# Altium schematic sheet 1.POWER.SchDoc
size A4; SheetNumber: 2; SheetTotal: 5
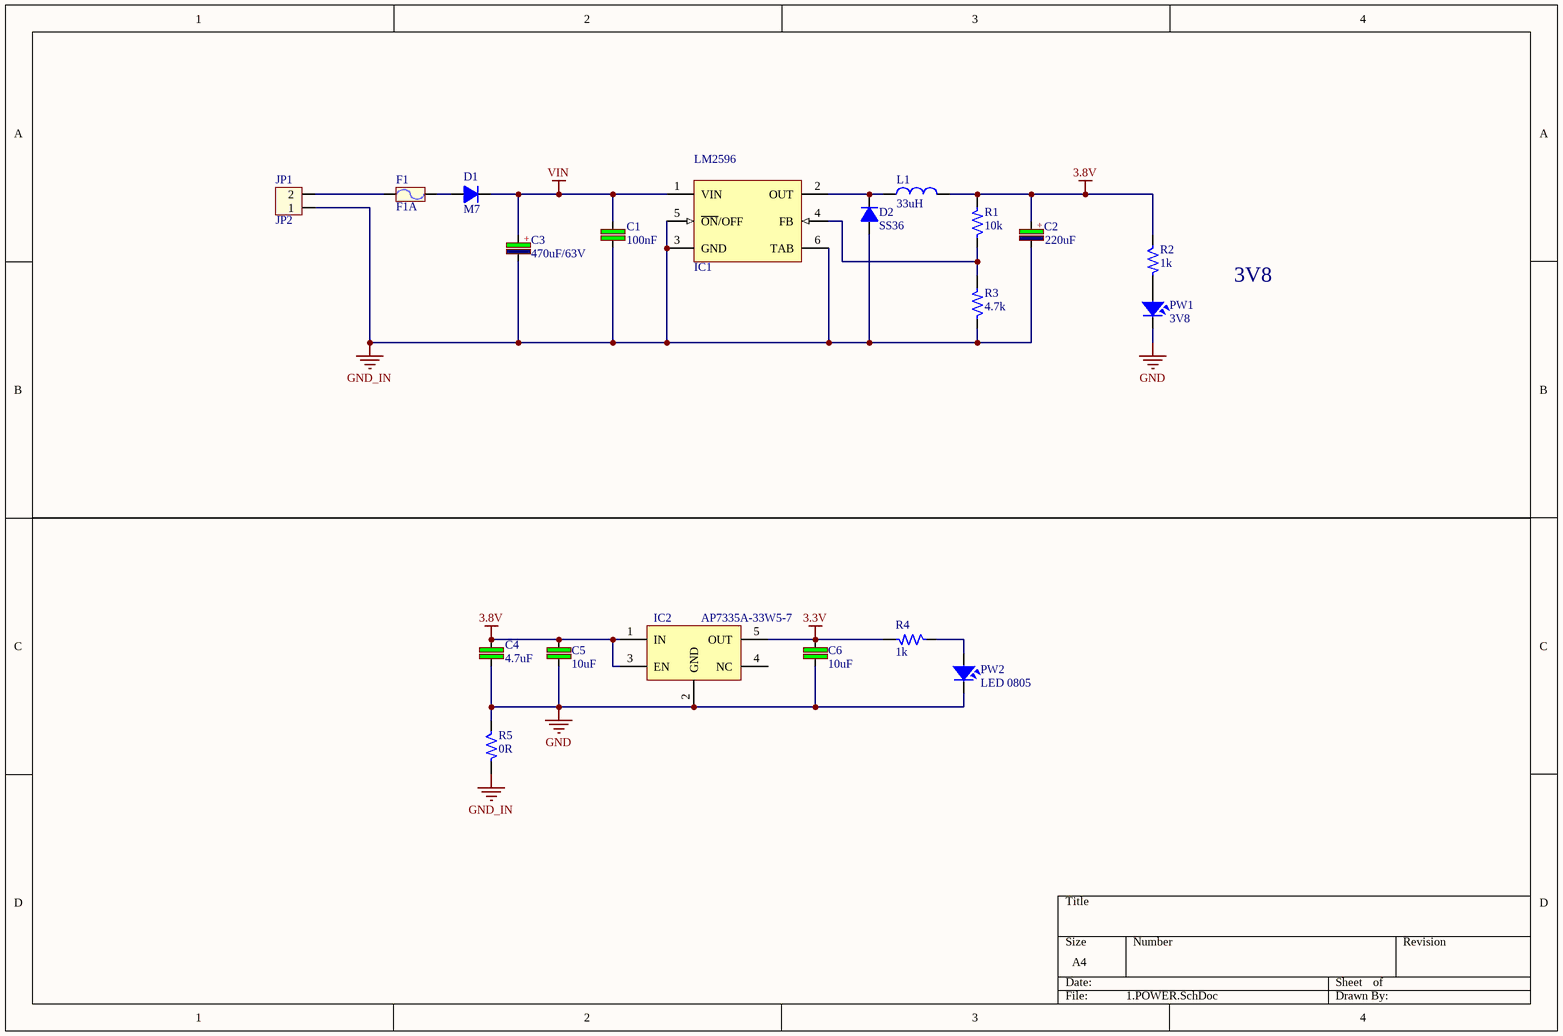
[diagram p0: 1.POWER.SchDoc]

## Parts
C1  value 100nF  [C-0805]  (hidden comment: 4.7uF)
C2  220uF  [EEFSDE]
C3  470uF/63V  [CAP-ALU-SMD-C]
C4  4.7uF  [C-0805]
C5  10uF  [C-0805]
C6  10uF  [C-0805]
D1  M7  [LED-0805-Blue]
D2  SS36  [LED-0805-Blue]
F1  F1A  [Fuse3]
IC1  LM2596  [TO-263]
IC2  AP7335A-33W5-7  [SOT23-5]
JP1  JP2  [KF2-5.08]
L1  33uH  [Inductor_SMD]
PW1  3V8  [LED-0805-Blue]
PW2  LED 0805  [LED-0805-Blue]
R1  10k  [R-0805]
R2  1k  [R-0805]
R3  4.7k  [R-0805]
R4  1k  [R-0805]
R5  0R  [R-0805]

## Nets
3.3V: C6.1 IC2.5(OUT) R4.2
3.8V: C2.1 C4.2 C5.1 IC2.1(IN) IC2.3(EN) L1.2 R1.2 R2.1
GND: C4.1 C5.2 C6.2 IC2.2(GND) PW1.2 PW2.2 R5.1
GND_IN: C1.1 C2.2 C3.2 D2.1(A) IC1.3(GND) IC1.5(~{ON}/OFF) IC1.6(TAB) JP1.1 R3.1 R5.2
VIN: C1.2 C3.1 D1.2(K) IC1.1(VIN)
NetD1_1: D1.1(A) F1.2
NetD2_2: D2.2(K) IC1.2(OUT) L1.1
NetF1_1: F1.1 JP1.2
NetIC1_4: IC1.4(FB) R1.1 R3.2
NetPW1_1: PW1.1 R2.2
NetPW2_1: PW2.1 R4.1

Not connected (* = marked no-connect by the designer): IC2 4(NC)

## Notes on the sheet
- 3V8
- (in symbol CP3) +
- (in symbol CP5) +

## Library data of the parts
C1 C4 = C: 4.7µF ±10% 35V Ceramic Capacitor X5R 0805 (2012 Metric); Manufacturer: Samsung Electro-Mechanics; Part number: CL21A475KLCLQNC; User_Description: CAP CER 4.7UF 35V X5R 0805; Category: CAPACITOR; Package: 0805
  C4: Value: 4.7uF
C2 = CP5: 220µF Molded Tantalum Polymer Capacitor 16V 2917 (7343 Metric) 40mOhm @ 100kHz; Manufacturer: AVX Corporation; Part number: TCME227M016R0040E; User_Description: CAP TANT POLY 220UF 16V 2917; Value: 220uF; Category: CAPACITOR; Package: 2917
C3 = CP3: Cap 470uF/63V; Value: Cap 470uF/63V
C5 C6 = C: Cap SMD; Manufacturer: Samsung Electro-Mechanics; Part number: CL21A106KPFNNNG; User_Description: CAP CER 10UF 10V X5R 0805; Value: 10uF; Category: CAPACITOR; Package: 0805
D1 = D1A: Diode 1A; Value: 1N4007
D2 = B340A: Diode Schottky 40V 3A Surface Mount DO-214AC (SMA); Manufacturer: Vishay General Semiconductor - Diodes Division; Part number: B340A-M3/61T; User_Description: DIODE SCHOTTKY 40V 3A DO214AC; Value: 40V 3A; Category: DIODE; Package: DO214AC
F1 = Fuse: Value: Fuse
IC1 = LM2576
JP1 = Con2: Connector 2; Value: Connector 2
L1 = L1: 22µH Shielded Inductor 1.65A 96mOhm Max Nonstandard; Manufacturer: Bourns Inc.; Part Number: SRR0745A-220M; Value: 220uH; User_Description: FIXED IND 22UH 1.65A 96 MOHM SMD; Category: INDUCTORS; Package: SMD
PW1 PW2 = LED: LED RED DIFFUSED 0805 SMD; Manufacturer: OSRAM Opto Semiconductors Inc.; Part number: LS R976-NR-1; Value: Red; Category: LED SMD; Package: 0805; User_Description: LED RED DIFFUSED 0805 SMD
R1 = R: RES SMD 10K OHM 1% 1/8W 0805; Manufacturer: Yageo; Part number: RC0805FR-0710KL; Category: RESISTORS; Package: 0805; User_Description: RES SMD 10K OHM 1% 1/8W 0805; Value: 10k
R2 R4 = R: Resistor 1/4W; Manufacturer: Yageo; Part number: RC0805FR-071KL; User_Description: RES SMD 1K OHM 1% 1/8W 0805; Value: 1k; Category: RESISTORS; Package: 0805
R3 = R: RES SMD 3.3K OHM 1% 1/8W 0805; Manufacturer: Yageo; Part number: RC0805FR-073K3L; Category: RESISTORS; Package: 0805; User_Description: RES SMD 3.3K OHM 1% 1/8W 0805; Value: 3.3k
R5 = R: Resistor 1/4W; Manufacturer: Yageo; Part number: RC0805FR-071KL; Value: 1k; User_Description: RES SMD 1K OHM 1% 1/8W 0805; Category: RESISTORS; Package: 0805
IC2 = AP7335A-33W5-7: Package: SOT23-5; Part number: AP7335A-33W5-7